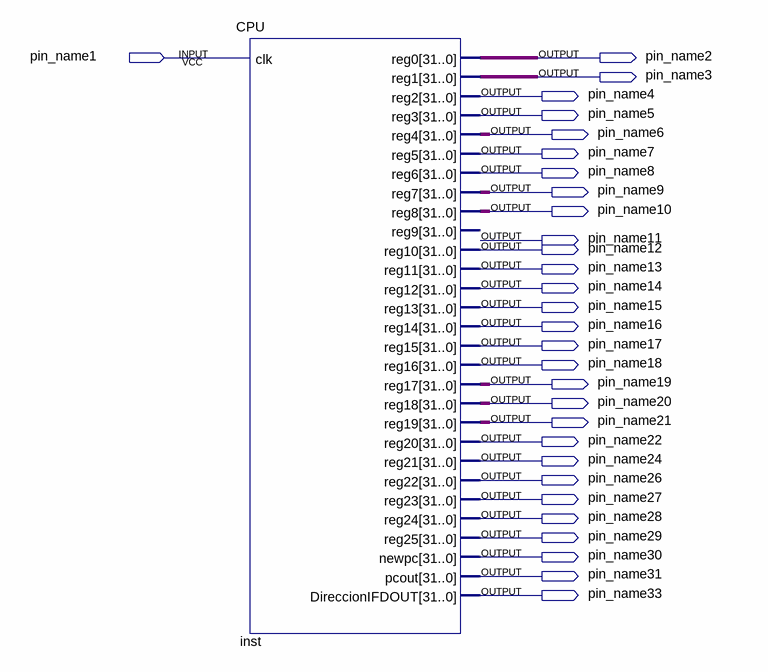
[diagram p0: schematic sheet]
// Quartus schematic cpuDiagram.bdf as structural Verilog: 1 symbols, 30 pins
module cpuDiagram (
  input  pin_name1,
  output pin_name2,
  output pin_name3,
  output pin_name4,
  output pin_name5,
  output pin_name6,
  output pin_name7,
  output pin_name8,
  output pin_name9,
  output pin_name10,
  output pin_name11,
  output pin_name12,
  output pin_name13,
  output pin_name14,
  output pin_name15,
  output pin_name16,
  output pin_name17,
  output pin_name18,
  output pin_name19,
  output pin_name20,
  output pin_name21,
  output pin_name22,
  output pin_name24,
  output pin_name26,
  output pin_name27,
  output pin_name28,
  output pin_name29,
  output pin_name30,
  output pin_name31,
  output pin_name33
);

  wire [31:0] inst_reg0, inst_reg1, inst_reg4, inst_reg7, inst_reg8, inst_reg17, inst_reg18, inst_reg19;

  CPU inst (
    .clk(pin_name1), .reg0(inst_reg0), .reg1(inst_reg1), .reg2(pin_name4), .reg3(pin_name5),
    .reg4(inst_reg4), .reg5(pin_name7), .reg6(pin_name8), .reg7(inst_reg7), .reg8(inst_reg8),
    .reg10(pin_name12), .reg11(pin_name13), .reg12(pin_name14), .reg13(pin_name15), .reg14(pin_name16),
    .reg15(pin_name17), .reg16(pin_name18), .reg17(inst_reg17), .reg18(inst_reg18), .reg19(inst_reg19),
    .reg20(pin_name22), .reg21(pin_name24), .reg22(pin_name26), .reg23(pin_name27), .reg24(pin_name28),
    .reg25(pin_name29), .newpc(pin_name30), .pcout(pin_name31), .DireccionIFDOUT(pin_name33));  // open: reg9
endmodule
